# EAGLE design board_revB (EAGLE 7.7.0)
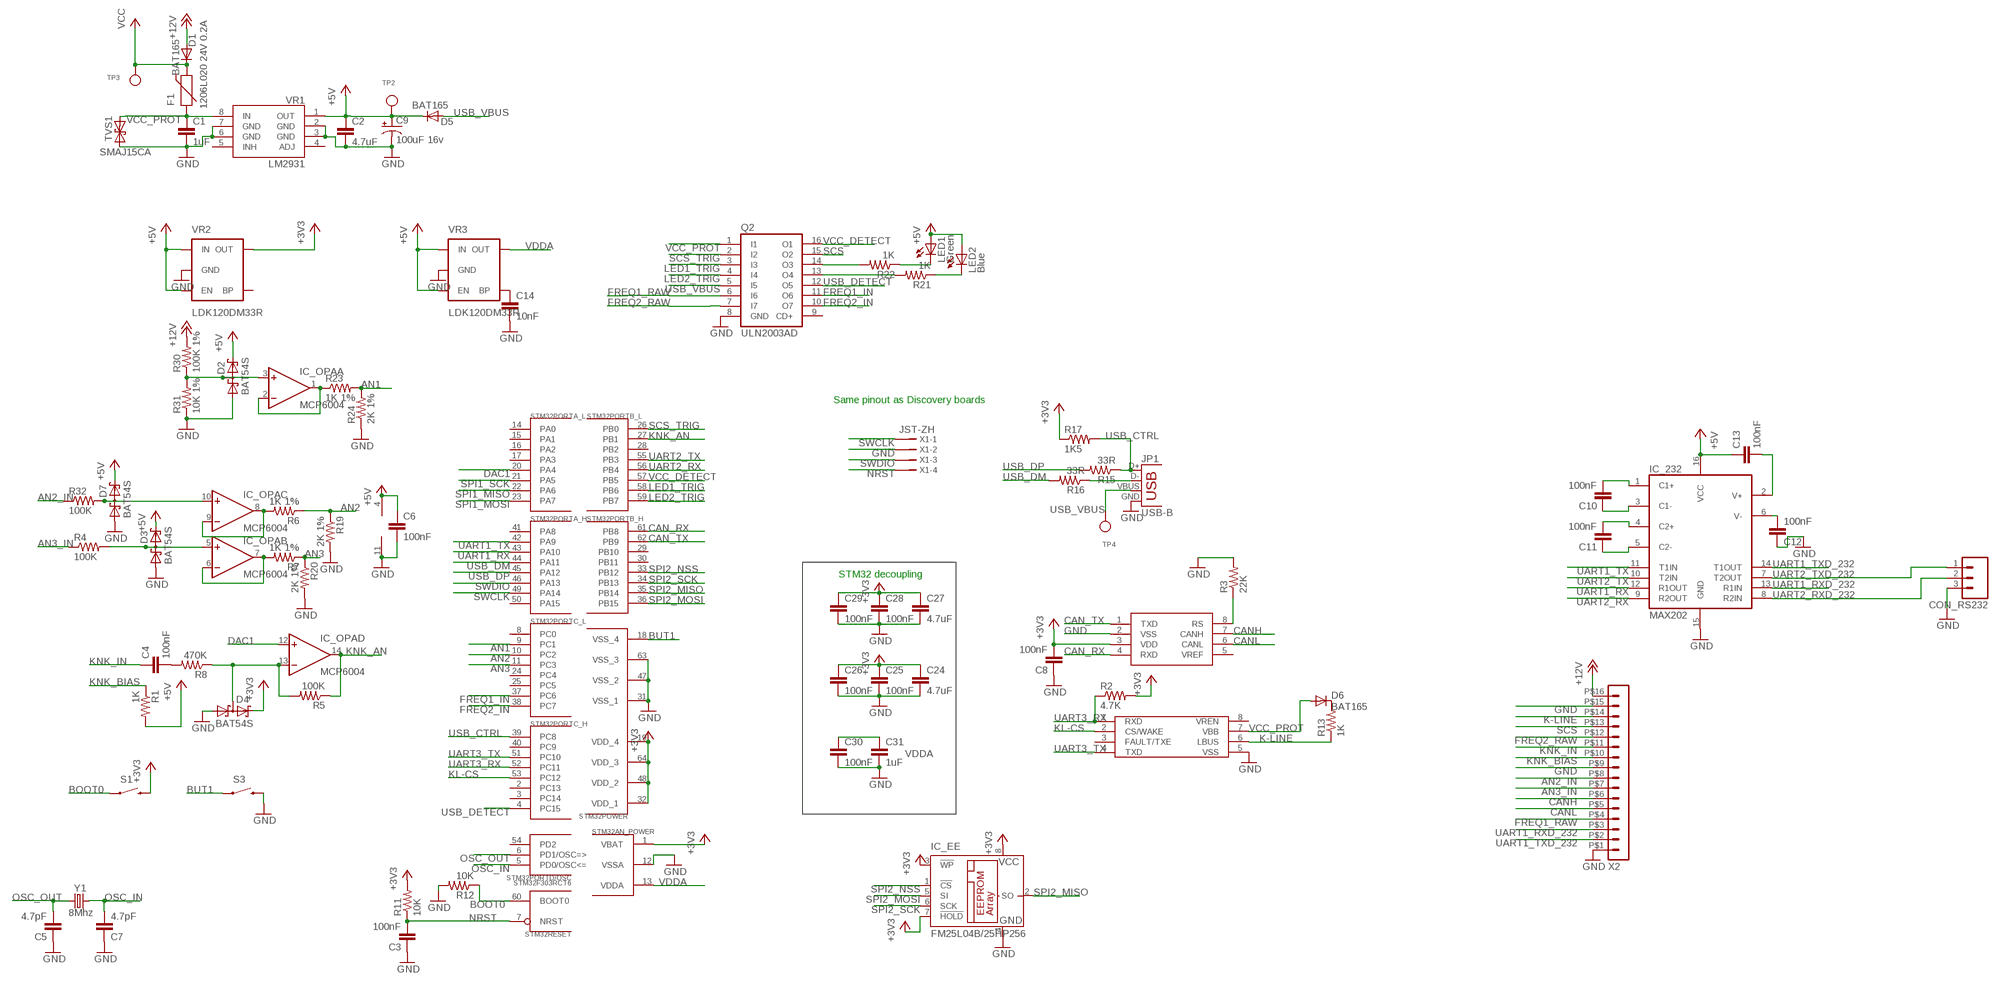
[diagram p0: schematic, sheet 1]

## Parts
C1  1uF  CAP0603-CAP  [0603-CAP]
C2  4.7uF  CAP0603-CAP  [0603-CAP]
C3  100nF  CAP0603-CAP  [0603-CAP]
C4  100nF  CAP0603-CAP  [0603-CAP]
C5  4.7pF  CAP0603-CAP  [0603-CAP]
C6  100nF  CAP0603-CAP  [0603-CAP]
C7  4.7pF  CAP0603-CAP  [0603-CAP]
C8  100nF  CAP0603-CAP  [0603-CAP]
C9  100uF 16v  CAP_POLPTH2  [CPOL-RADIAL-10UF-25V]
C10  100nF  CAP0603-CAP  [0603-CAP]
C11  100nF  CAP0603-CAP  [0603-CAP]
C12  100nF  CAP0603-CAP  [0603-CAP]
C13  100nF  CAP0603-CAP  [0603-CAP]
C14  10nF  CAP0603-CAP  [0603-CAP]
C24  4.7uF  CAP0603-CAP  [0603-CAP]
C25  100nF  CAP0603-CAP  [0603-CAP]
C26  100nF  CAP0603-CAP  [0603-CAP]
C27  4.7uF  CAP0603-CAP  [0603-CAP]
C28  100nF  CAP0603-CAP  [0603-CAP]
C29  100nF  CAP0603-CAP  [0603-CAP]
C30  100nF  CAP0603-CAP  [0603-CAP]
C31  1uF  CAP0603-CAP  [0603-CAP]
CON_RS232  M03LOCK  [1X03_LOCK]
D1  BAT165  DIODESOD  [SOD-323]
D2  BAT54S  [SOT23]
D3  BAT54S  [SOT23]
D4  BAT54S  [SOT23]
D5  BAT165  DIODESOD  [SOD-323]
D6  BAT165  DIODESOD  [SOD-323]
D7  BAT54S  [SOT23]
F1  1206L020 24V 0.2A  PTCSMD  [PTC-1206]
IC_232  MAX202  MAX232TSSOP  [TSSOP16]
IC_CAN  MAX3051  MCP2551  [SO08]
IC_EE  FM25L04B/25HP256  25LC080SN  [SO-08]
IC_KLINE  TJA1027  MCP2004  [SO08]
IC_OPA  MCP6004  LMV324MZ  [TSSOP14]
JP1  USB-B  USBPTH  [USB-B-PTH]
LED1  Green  LED3MM  [LED3MM]
LED2  Blue  LED3MM  [LED3MM]
Q2  ULN2003AD  [SO16]
R1  1K  RESISTOR0603-RES  [0603-RES]
R2  4.7K  RESISTOR0603-RES  [0603-RES]
R3  22K  RESISTOR0603-RES  [0603-RES]
R4  100K  RESISTOR0603-RES  [0603-RES]
R5  100K  RESISTOR0603-RES  [0603-RES]
R6  1K 1%  RESISTOR0603-RES  [0603-RES]
R7  1K 1%  RESISTOR0603-RES  [0603-RES]
R8  470K  RESISTOR0603-RES  [0603-RES]
R11  10K  RESISTOR0603-RES  [0603-RES]
R12  10K  RESISTOR0603-RES  [0603-RES]
R13  1K  RESISTOR0603-RES  [0603-RES]
R15  33R  RESISTOR0603-RES  [0603-RES]
R16  33R  RESISTOR0603-RES  [0603-RES]
R17  1K5  RESISTOR0603-RES  [0603-RES]
R19  2K 1%  RESISTOR0603-RES  [0603-RES]
R20  2K 1%  RESISTOR0603-RES  [0603-RES]
R21  1K  RESISTOR0603-RES  [0603-RES]
R22  1K  RESISTOR0603-RES  [0603-RES]
R23  1K 1%  RESISTOR0603-RES  [0603-RES]
R24  2K 1%  RESISTOR0603-RES  [0603-RES]
R30  100K 1%  RESISTOR0603-RES  [0603-RES]
R31  10K 1%  RESISTOR0603-RES  [0603-RES]
R32  100K  RESISTOR0603-RES  [0603-RES]
S1  SWITCH-MOMENTARY-2SMD-4  [TACTILE_SWITCH_TALL]
S3  SWITCH-MOMENTARY-2SIDE_EZ  [TACTILE-PTH-SIDEEZ]
STM32  STM32F303RCT6  STM32F10XRXT6  [TQFP64]
TP2  TESTPOINTROUND1MM  [TESTPOINT_ROUND_1MM]
TP3  TESTPOINTROUND1MM  [TESTPOINT_ROUND_1MM]
TP4  TESTPOINTROUND1MM  [TESTPOINT_ROUND_1MM]
TVS1  SMAJ15CA  TVS  [SMA-DIODE]
VR1  LM2931  [SO08]
VR2  LDK120DM33R  V_REG_LDOSMD  [SOT23-5]
VR3  LDK120DM33R  V_REG_LDOSMD  [SOT23-5]
X1  JST-ZH  S4B-ZR  [S4B-ZR]
X2  HEADER_POS16_43045-1600  [43045-1600]
Y1  8Mhz  CRYSTALHC49US  [HC49US]

## Nets
+3V3: C8.2 C24.1 C25.1 C26.1 C27.1 C28.1 C29.1 D4.2(C2) IC_CAN.3(VDD) IC_EE.3(!WP) IC_EE.7(!HOLD) IC_EE.8(VCC) R2.2 R11.2 R17.1 S1.B2 STM32.1(AN_POWER:VBAT) STM32.19(POWER:VDD_4) STM32.32(POWER:VDD_1) STM32.48(POWER:VDD_2) STM32.64(POWER:VDD_3) VR2.5(OUT)
+5V: C2.1 C6.1 C9.1(+) C13.1 D2.2(C2) D3.2(C2) D5.1(C) D7.2(C2) IC_232.16(VCC) IC_OPA.4(P:V+) LED1.A LED2.A R1.2 TP2.P$1 VR1.1(OUT) VR2.1(IN) VR2.3(EN) VR3.1(IN) VR3.3(EN)
+12V: D1.2(A) R30.2 X2.P$16
AN1: R23.2 R24.2 STM32.9(PORTC_L:PC1)
AN1_N: IC_OPA.1(A:OUT) IC_OPA.2(A:-IN) R23.1
AN2: R6.1 R19.1 STM32.10(PORTC_L:PC2)
AN2_IN: R32.1 X2.P$8
AN2_N: IC_OPA.8(C:OUT) IC_OPA.9(C:-IN) R6.2
AN3: R7.1 R20.1 STM32.11(PORTC_L:PC3)
AN3_IN: R4.1 X2.P$7
AN3_N: IC_OPA.6(B:-IN) IC_OPA.7(B:OUT) R7.2
BOOT0: R12.1 S1.A2 STM32.60(RESET:BOOT0)
BUT1: S3.1 STM32.18(POWER:VSS_4)
CAN_RX: IC_CAN.4(RXD) STM32.61(PORTB_H:PB8)
CAN_TX: IC_CAN.1(TXD) STM32.62(PORTB_H:PB9)
CANH: IC_CAN.7(CANH) X2.P$6
CANL: IC_CAN.6(CANL) X2.P$5
DAC1: IC_OPA.12(D:+IN) STM32.20(PORTA_L:PA4)
FREQ1_IN: Q2.11(O6) STM32.37(PORTC_L:PC6)
FREQ1_RAW: Q2.6(I6) X2.P$4
FREQ2_IN: Q2.10(O7) STM32.38(PORTC_L:PC7)
FREQ2_RAW: Q2.7(I7) X2.P$12
GND: C1.2 C2.2 C3.1 C5.1 C6.2 C7.1 C8.1 C9.2(-) C12.1 C14.2 C24.2 C25.2 C26.2 C27.2 C28.2 C29.2 C30.2 C31.2 CON_RS232.3 D2.1(A1) D3.1(A1) D4.1(A1) D7.1(A1) IC_232.15(GND) IC_CAN.2(VSS) IC_EE.4(GND) IC_KLINE.5(VSS) IC_OPA.11(P:V-) JP1.GND Q2.8(GND) R3.2 R12.2 R19.2 R20.2 R24.1 R31.1 S3.2 STM32.12(AN_POWER:VSSA) STM32.31(POWER:VSS_1) STM32.47(POWER:VSS_2) STM32.63(POWER:VSS_3) TVS1.A VR1.2(GND) VR1.3(GND) VR1.6(GND) VR1.7(GND) VR2.2(GND) VR3.2(GND) X1.2 X2.P$1 X2.P$9 X2.P$15
K-LINE: IC_KLINE.6(LBUS) R13.1 X2.P$14
KL-CS: IC_KLINE.2(CS/WAKE) STM32.53(PORTC_H:PC12)
KNK_AN: IC_OPA.14(D:OUT) R5.1 STM32.27(PORTB_L:PB1)
KNK_BIAS: R1.1 X2.P$10
KNK_IN: C4.1 X2.P$11
LED1_TRIG: Q2.3(I3) STM32.58(PORTB_L:PB6)
LED2_TRIG: Q2.4(I4) STM32.59(PORTB_L:PB7)
N$4: D4.3(C1A2) IC_OPA.13(D:-IN) R5.2 R8.1
N$5: D3.3(C1A2) IC_OPA.5(B:+IN) R4.2
N$6: C4.2 R8.2
N$8: IC_CAN.8(RS) R3.1
N$9: C14.1 VR3.4(BP)
N$10: LED2.K(C) R21.1
N$11: Q2.13(O4) R21.2
N$13: D6.1(C) R13.2
N$15: Q2.14(O3) R22.2
N$17: JP1.D- R16.1
N$19: LED1.K(C) R22.1
N$20: C11.2 IC_232.4(C2+)
N$22: C11.1 IC_232.5(C2-)
N$23: C10.1 IC_232.3(C1-)
N$24: D2.3(C1A2) IC_OPA.3(A:+IN) R30.1 R31.2
N$25: D7.3(C1A2) IC_OPA.10(C:+IN) R32.2
N$26: C10.2 IC_232.1(C1+)
N$27: C12.2 IC_232.6(V-)
N$29: C13.2 IC_232.2(V+)
NRST: C3.2 R11.1 STM32.7(RESET:NRST) X1.4
OSC_IN: C7.2 STM32.5(PORTD/OSC:PD0/OSC<=) Y1.2
OSC_OUT: C5.2 STM32.6(PORTD/OSC:PD1/OSC=>) Y1.1
SCS: Q2.15(O2) X2.P$13
SCS_TRIG: Q2.2(I2) STM32.26(PORTB_L:PB0)
SPI1_MISO: STM32.22(PORTA_L:PA6)
SPI1_MOSI: STM32.23(PORTA_L:PA7)
SPI1_SCK: STM32.21(PORTA_L:PA5)
SPI2_MISO: IC_EE.2(SO) STM32.35(PORTB_H:PB14)
SPI2_MOSI: IC_EE.5(SI) STM32.36(PORTB_H:PB15)
SPI2_NSS: IC_EE.1(!CS) STM32.33(PORTB_H:PB12)
SPI2_SCK: IC_EE.6(SCK) STM32.34(PORTB_H:PB13)
SWCLK: STM32.49(PORTA_H:PA14) X1.1
SWDIO: STM32.46(PORTA_H:PA13) X1.3
UART1_RX: IC_232.12(R1OUT) STM32.43(PORTA_H:PA10)
UART1_RXD_232: IC_232.13(R1IN) X2.P$3
UART1_TX: IC_232.11(T1IN) STM32.42(PORTA_H:PA9)
UART1_TXD_232: IC_232.14(T1OUT) X2.P$2
UART2_RX: IC_232.9(R2OUT) STM32.56(PORTB_L:PB4)
UART2_RXD_232: CON_RS232.2 IC_232.8(R2IN)
UART2_TX: IC_232.10(T2IN) STM32.55(PORTB_L:PB3)
UART2_TXD_232: CON_RS232.1 IC_232.7(T2OUT)
UART3_RX: IC_KLINE.1(RXD) R2.1 STM32.52(PORTC_H:PC11)
UART3_TX: IC_KLINE.4(TXD) STM32.51(PORTC_H:PC10)
USB_CTRL: JP1.D+ R15.1 R17.2 STM32.39(PORTC_H:PC8)
USB_DETECT: Q2.12(O5) STM32.4(PORTC_H:PC15)
USB_DM: R16.2 STM32.44(PORTA_H:PA11)
USB_DP: R15.2 STM32.45(PORTA_H:PA12)
USB_VBUS: D5.2(A) JP1.VBUS Q2.5(I5) TP4.P$1
VCC: D1.1(C) F1.2 TP3.P$1
VCC_DETECT: Q2.16(O1) STM32.57(PORTB_L:PB5)
VCC_PROT: C1.1 D6.2(A) F1.1 IC_KLINE.7(VBB) Q2.1(I1) TVS1.C VR1.8(IN)
VDDA: C30.1 C31.1 STM32.13(AN_POWER:VDDA) VR3.5(OUT)
Unconnected: IC_CAN.5(VREF) IC_KLINE.3(FAULT/TXE) IC_KLINE.8(VREN) Q2.9(CD+) STM32.2(PORTC_H:PC13) STM32.3(PORTC_H:PC14) STM32.8(PORTC_L:PC0) STM32.14(PORTA_L:PA0) STM32.15(PORTA_L:PA1) STM32.16(PORTA_L:PA2) STM32.17(PORTA_L:PA3) STM32.24(PORTC_L:PC4) STM32.25(PORTC_L:PC5) STM32.28(PORTB_L:PB2) STM32.29(PORTB_H:PB10) STM32.30(PORTB_H:PB11) STM32.40(PORTC_H:PC9) STM32.41(PORTA_H:PA8) STM32.50(PORTA_H:PA15) STM32.54(PORTD/OSC:PD2) VR1.4(ADJ) VR1.5(INH) VR2.4(BP)

## Notes on the sheet
- Same pinout as Discovery boards
- STM32 decoupling

## Library data of the parts
C1 C2 C24 C27 = SparkFun-Passives:CAP: Capacitor Standard 0603 ceramic capacitor, and 0.1" leaded capacitor.
C3-C8 C10-C14 C25 C26 C28-C31 = SparkFun-Capacitors:CAP: Capacitor Standard 0603 ceramic capacitor, and 0.1" leaded capacitor.
C9 = SparkFun-Passives:CAP_POL: Capacitor Polarized These are standard SMD and PTH capacitors. Normally 10uF, 47uF, and 100uF in electrolytic and tantalum varieties. Always verify the external diameter of the through hole cap, it varies with capacity, voltage, and manufacturer. The EIA devices should be standard.
CON_RS232 = SparkFun-Connectors:M03: Header 3 Standard 3-pin 0.1" header. Use with straight break away headers (SKU : PRT-00116), right angle break away headers (PRT-00553), swiss pins (PRT-00743), machine pins (PRT-00117), and female headers (PRT-00115). Molex polarized connector foot print use with SKU : PRT-08232 with associated crimp pins and housings.
D1 D5 D6 = SparkFun-DiscreteSemi:DIODE: Diode These are standard reverse protection diodes and small signal diodes. SMA package can handle up to about 1A. SOD-323 can handle about 200mA. What the SOD-323 package when ordering, there are some mfgs out there that are 5-pin packages.
D2-D4 D7 = diode:BAT54S: Schottky Diodes Pin connection corrected 2011-05-04 Source: Fairchild .. BAT54.pdf
F1 = misc:PTC: Resettable Fuse PTC Resettable Fuse. Spark Fun Electronics SKU : COM-08357; PROD_ID: RES-11150
IC_232 = SparkFun-DigitalIC:MAX232: RS232 Transceiver Very common IC. This is generically called 'MAX232', but works with the 3V equivalent MAX3232 generic ICs. Field tested and mother approved. Spark Fun Electronics SKU : COM-00316 (DIP) and COM-00589 (SMD)
IC_CAN = SparkFun-DigitalIC:MCP2551: CAN transceiver
IC_EE = microchip:25*: Serial EEPROM 4K/ 8K , SPI bus; MF: MICROCHIP; MPN: 25LC080/SN; OC_FARNELL: 1137302; OC_NEWARK: 96K4092
IC_KLINE = misc:MCP2004
IC_OPA = linear:LMV324?*: Quad General Purpose, Low Voltage, Rail-to-Rail Output Operational Amplifiers Source: http://www.national.com/mpf/LM/LMV321.html http://www.national.com/dt/lmv_qual.pdf
JP1 = SparkFun-Connectors:USB: USB Connectors USB-B-PTH is fully proven SKU : PRT-00139/CONN-08278 USB-miniB is fully proven SKU : PRT-00587 USB-A-PCB is untested. USB-A-H is throughly reviewed, but untested. Spark Fun Electronics SKU : PRT-00437 USB-B-SMT is throughly reviewed, but untested. Needs silkscreen touching up. USB-A-S has not been used/tested USB-MB-H has not been used/tested USB-MICROB has been used. CONN-09505; PROD_ID: CONN-08278
LED1 LED2 = SparkFun-LED:LED: LEDs Standard schematic elements and footprints for 5mm, 3mm, 1206, and 0603 sized LEDs. 5mm - Spark Fun Electronics SKU : COM-00529 (and others)
Q2 = misc:ULN2003A: DRIVER ARRAY
R1-R8 R11-R13 R15-R17 R19-R24 R30-R32 = SparkFun-Resistors:RESISTOR: Resistor Basic schematic elements and footprints for 0603, 1206, and PTH resistors.
S1 = SparkFun-Electromechanical:SWITCH-MOMENTARY-2: Various NO switches- pushbuttons, reed, etc; PROD_ID: SWCH-11966
S3 = SparkFun-Electromechanical:SWITCH-MOMENTARY-2: Various NO switches- pushbuttons, reed, etc
STM32 = stm32:STM32F10XRXT6: STM32F101/103 64pin LQFP
TP2-TP4 = microbuilder:TESTPOINT: Test Point Various test points for characterisation and PCB testing TESTPOINT_SMT - Compact Surface Mount Test Point [Digikey: 5016KTR-ND]
TVS1 = SparkFun-DiscreteSemi:TVS: Transient voltage suppressor- prevents ESD on inputs. Ignore package description- MBRA140 is NOT this type of part!!!
VR1 = SparkFun-PowerIC:LM2931: LDO regulator with reverse battery protection- very durable!
VR2 VR3 = SparkFun-PowerIC:V_REG_LDO: Voltage Regulator LDO Standard 150mA LDO voltage regulator in SOT-23 layout. Micrel part MIC5205. BP (by-pass) pin is used to lower output noise with 470pF cap.
X1 = con-jst:?4B-ZR: ZH CONNECTOR 1.5 mm, 4 pin 1 row Source: http://www.jst.com .. eZH.pdf; MF: FARNELL; MPN: S4B-ZR(LF)(SN); OC_FARNELL: 9491830; OC_NEWARK: 38K8076
X2 = con-molex-micro-fit-3_0:HEADER_POS16_?: Molex - Micro-Fit 3.0 Series connector, 3.00mm (0.118") pitch header, 16 positions.
Y1 = SparkFun-FreqCtrl:CRYSTAL: Various standard crystals. Proven footprints. Spark Fun Electronics SKU : COM-00534

## Net classes
1 HV: width 0.813 mm, clearance 0.61 mm

## Board
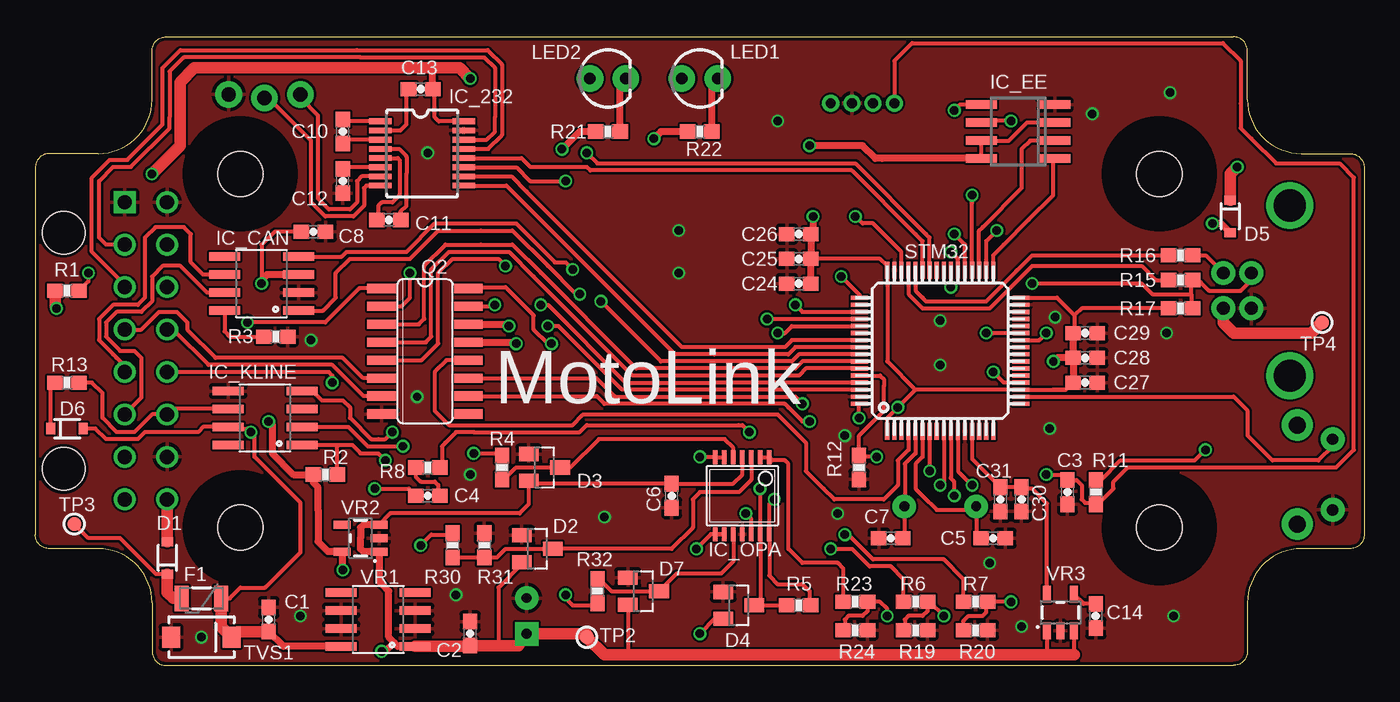
[diagram p1: board, top side]
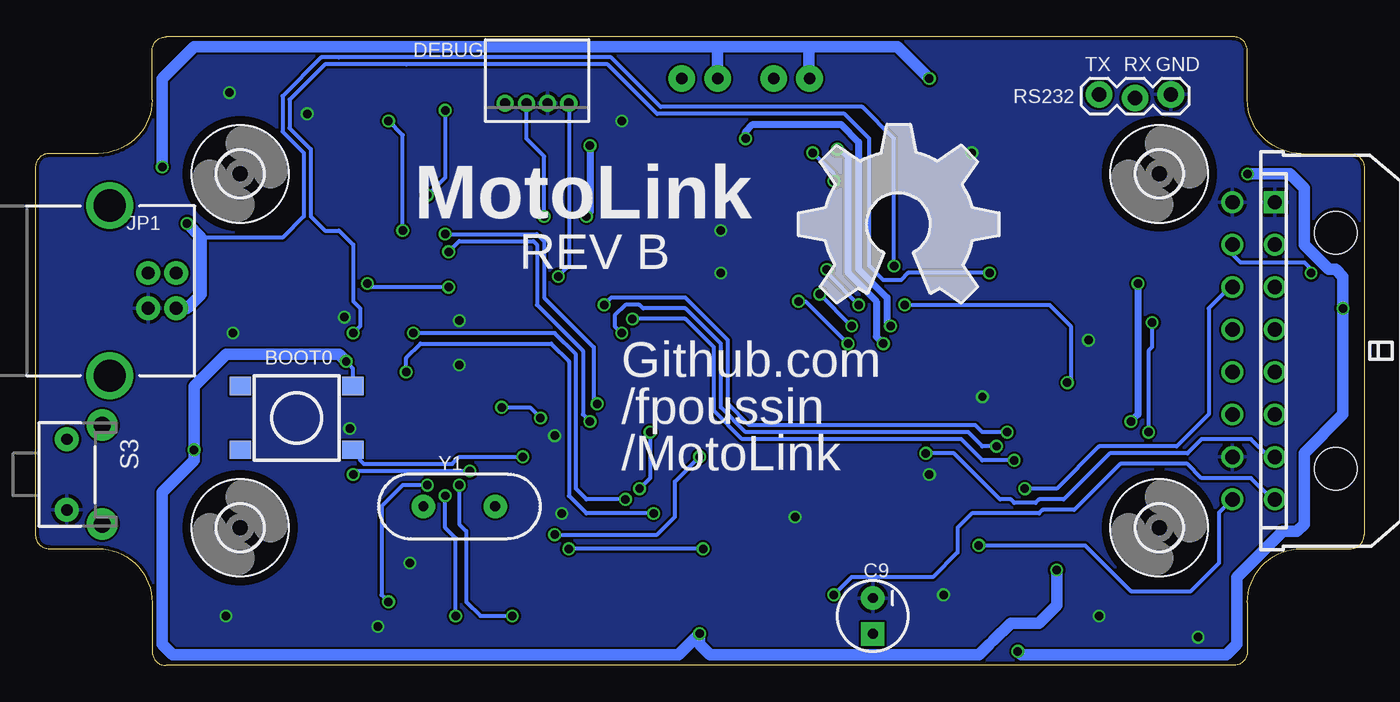
[diagram p2: board, bottom side, seen from below]

Size 93.98 x 44.45 mm. Coordinates in mm from the lower left corner, seen from the top.
Outline: 85.72,4.45 85.72,1 arc-90 84.72,0 9.26,0 arc-90 8.26,1 8.26,4.45 arc90 4.45,8.26 1,8.26 arc-90 0,9.26 0,35.2 arc-90 1,36.2 4.45,36.2 arc90 8.26,40.01 8.26,43.45 arc-90 9.26,44.45 84.72,44.45 arc-90 85.72,43.45 85.72,40.01 arc90 89.53,36.2 92.98,36.2 arc-90 93.98,35.2 93.98,9.26 arc-90 92.98,8.26 89.53,8.26 arc90 85.72,4.45
Copper layers (1*16): Top 0.035mm / dielectric 1.5mm / Bottom 0.035mm
Design rules "SeeedStudio_2layer_DRU_no_angle_20140221 *": minimum track width 8mil, minimum drill 12mil, track to track 6mil, track to pad 6mil, pad to pad 6mil, via to via 6mil, smd to smd 0mil, copper to edge 10mil, drill to drill 10mil, minimum pad ring 10mil, minimum via ring 6mil, stop-mask expansion 2mil, vias tented up to drill 100mil, thermal gap 10mil

### Footprints (pad centres in the part's own frame; a part is rotated, then mirrored left to right if it is on the bottom)
0603-CAP = smd 1.1 x 1: 1 -0.85,0; 2 0.85,0
CPOL-RADIAL-10UF-25V = drill 0.7 pad 1.651 square: 1 1.27,0 | drill 0.7 pad 1.651: 2 -1.27,0
1X03_LOCK = drill 1.016 pad 1.88: 1 0,0.127; 2 2.54,-0.127; 3 5.08,0.127
SOD-323 = smd 0.63 x 0.83: 1 -1.15,0; 2 1.15,0
SOT23 = smd 1 x 1.4: 1 -0.95,-1.1; 2 0.95,-1.1; 3 0,1.1
PTC-1206 = smd 1 x 1.8: 1 -1.4,0; 2 1.4,0
TSSOP16 = smd 0.4 x 1.6: 1 -2.225,-2.85; 2 -1.575,-2.85; 3 -0.925,-2.85; 4 -0.275,-2.85; 5 0.375,-2.85; 6 1.025,-2.85; 7 1.675,-2.85; 8 2.325,-2.85; 9 2.325,3.05; 10 1.675,3.05; 11 1.025,3.05; 12 0.375,3.05; 13 -0.275,3.05; 14 -0.925,3.05; 15 -1.575,3.05; 16 -2.225,3.05
SO08 = smd 0.61 x 2.21: 1 -1.905,-2.616; 2 -0.635,-2.616; 3 0.635,-2.616; 4 1.905,-2.616; 5 1.905,2.616; 6 0.635,2.616; 7 -0.635,2.616; 8 -1.905,2.616
SO-08 = smd 0.6 x 2.2: 1 -1.905,-2.6; 2 -0.635,-2.6; 3 0.635,-2.6; 4 1.905,-2.6; 5 1.905,2.6; 6 0.635,2.6; 7 -0.635,2.6; 8 -1.905,2.6
TSSOP14 = smd 0.305 x 0.991: 1 -1.905,-2.718; 2 -1.27,-2.718; 3 -0.635,-2.718; 4 0,-2.718; 5 0.635,-2.718; 6 1.27,-2.718; 7 1.905,-2.718; 8 1.905,2.718; 9 1.27,2.718; 10 0.635,2.718; 11 0,2.718; 12 -0.635,2.718; 13 -1.27,2.718; 14 -1.905,2.718
USB-B-PTH = drill 0.914 pad 1.676: D+ 0,1.25; D- 1.981,1.25; GND 0,-1.25; VBUS 1.981,-1.25 | drill 2.286: S1 -2.718,-6.02; S2 -2.718,6.02
LED3MM = drill 0.813 pad 1.88: A -1.27,0; K 1.27,0
SO16 = smd 0.66 x 2.032: 1 -4.445,-3.073; 2 -3.175,-3.073; 3 -1.905,-3.073; 4 -0.635,-3.073; 5 0.635,-3.073; 6 1.905,-3.073; 7 3.175,-3.073; 8 4.445,-3.073; 9 4.445,3.073; 10 3.175,3.073; 11 1.905,3.073; 12 0.635,3.073; 13 -0.635,3.073; 14 -1.905,3.073; 15 -3.175,3.073; 16 -4.445,3.073
0603-RES = smd 1.1 x 1: 1 -0.85,0; 2 0.85,0
TACTILE_SWITCH_TALL = smd 1.55 x 1.3: A1 -3.975,-2.25; A2 3.975,-2.25; B1 -3.975,2.25; B2 3.975,2.25
TACTILE-PTH-SIDEEZ = drill 0.8 pad 1.7: 1 -2.5,0; 2 2.5,0 | drill 1.2 pad 2.2: ANCHOR1 -3.5,2.5; ANCHOR2 3.5,2.5
TQFP64 = smd 1.2 x 0.3: 1 -5.7,3.75; 2 -5.7,3.25; 3 -5.7,2.75; 4 -5.7,2.25; 5 -5.7,1.75; 6 -5.7,1.25; 7 -5.7,0.75; 8 -5.7,0.25; 9 -5.7,-0.25; 10 -5.7,-0.75; 11 -5.7,-1.25; 12 -5.7,-1.75; 13 -5.7,-2.25; 14 -5.7,-2.75; 15 -5.7,-3.25; 16 -5.7,-3.75; 33 5.7,-3.75; 34 5.7,-3.25; 35 5.7,-2.75; 36 5.7,-2.25; 37 5.7,-1.75; 38 5.7,-1.25; 39 5.7,-0.75; 40 5.7,-0.25; 41 5.7,0.25; 42 5.7,0.75; 43 5.7,1.25; 44 5.7,1.75; 45 5.7,2.25; 46 5.7,2.75; 47 5.7,3.25; 48 5.7,3.75 | smd 0.3 x 1.2: 17 -3.75,-5.7; 18 -3.25,-5.7; 19 -2.75,-5.7; 20 -2.25,-5.7; 21 -1.75,-5.7; 22 -1.25,-5.7; 23 -0.75,-5.7; 24 -0.25,-5.7; 25 0.25,-5.7; 26 0.75,-5.7; 27 1.25,-5.7; 28 1.75,-5.7; 29 2.25,-5.7; 30 2.75,-5.7; 31 3.25,-5.7; 32 3.75,-5.7; 49 3.75,5.7; 50 3.25,5.7; 51 2.75,5.7; 52 2.25,5.7; 53 1.75,5.7; 54 1.25,5.7; 55 0.75,5.7; 56 0.25,5.7; 57 -0.25,5.7; 58 -0.75,5.7; 59 -1.25,5.7; 60 -1.75,5.7; 61 -2.25,5.7; 62 -2.75,5.7; 63 -3.25,5.7; 64 -3.75,5.7
TESTPOINT_ROUND_1MM = smd 1 x 1: P$1 0,0
SMA-DIODE = smd 1.27 x 1.47: A -2.15,0; C 2.15,0
3,2 = hole 3.2: 0,0
SOT23-5 = smd 0.55 x 1.2: 1 -0.95,-1.3; 2 0,-1.3; 3 0.95,-1.3; 4 0.95,1.3; 5 -0.95,1.3
S4B-ZR = drill 0.7 pad 1.1: 1 -2.25,0; 2 -0.75,0; 3 0.75,0; 4 2.25,0
43045-1600 = drill 1.02 square: P$1 10.5,4.32 | drill 1.02: P$2 7.5,4.32; P$3 4.5,4.32; P$4 1.5,4.32; P$5 -1.5,4.32; P$6 -4.5,4.32; P$7 -7.5,4.32; P$8 -10.5,4.32; P$9 10.5,7.32; P$10 7.5,7.32; P$11 4.5,7.32; P$12 1.5,7.32; P$13 -1.5,7.32; P$14 -4.5,7.32; P$15 -7.5,7.32; P$16 -10.5,7.32 | hole 3: 8.35,0; -8.35,0
HC49US = drill 0.7 pad 1.651: 1 -2.54,0; 2 2.54,0

### Placement (x,y rotation side)
C1  16.5,3.25 90 top
C2  30.75,2.25 90 top
C3  73,12.25 90 top
C4  27.75,12 0 top
C5  67.75,9 180 top
C6  45,12 270 top
C7  60.5,9 0 top
C8  19.68,30.66 180 top
C9  34.75,3.5 270 bottom
C10  21.75,37.75 90 top
C11  25,31.5 0 top
C12  21.75,34.25 90 top
C13  27.25,40.75 180 top
C14  75,3.5 270 top
C24  54,27 180 top
C25  54,28.75 180 top
C26  54,30.5 180 top
C27  74.25,20 0 top
C28  74.25,21.75 0 top
C29  74.25,23.5 0 top
C30  69.75,11.75 270 top
C31  68.25,11.75 270 top
CON_RS232  18.75,40.25 0 bottom
D1  9.34,7.61 90 top
D2  35.5,8.25 270 top
D3  36,14 270 top
D4  49.75,4.25 270 top
D5  84.5,31.75 270 top
D6  2.25,16.75 0 top
D7  43,5.25 270 top
F1  11.75,4.75 180 top
IC_232  27.25,36.25 270 top
IC_CAN  16,27 90 top
IC_EE  69.5,37.75 90 top
IC_KLINE  16.25,17.5 90 top
IC_OPA  50,12 180 top
JP1  86,26.5 0 bottom
LED1  47,41.5 0 top
LED2  40.5,41.5 0 top
Q2  27.56,22.22 270 top
R1  2.25,26.5 180 top
R2  20.5,13.5 180 top
R3  17,23.25 0 top
R4  33,14 270 top
R5  54,4.25 180 top
R6  62.25,4.5 180 top
R7  66.5,4.5 180 top
R8  27.75,14 180 top
R11  75,12.25 90 top
R12  58.25,14 270 top
R13  2.25,20 180 top
R15  81,27.25 180 top
R16  81,29 180 top
R17  81,25.25 0 top
R19  62.25,2.5 0 top
R20  66.5,2.5 0 top
R21  40.5,37.75 180 top
R22  47,37.75 180 top
R23  58,4.5 0 top
R24  58,2.5 180 top
R30  29.5,8.5 90 top
R31  31.75,8.5 270 top
R32  39.75,5.25 90 top
S1  75.5,17.5 0 bottom
S3  91.75,13.5 270 bottom
STM32  64,22.25 90 top
TP2  39,2 90 top
TP3  2.75,10 0 top
TP4  91,24.25 180 top
TVS1  11.75,2 0 top
U$2  [3,2]  14.5,34.75 0 bottom
U$3  [3,2]  14.5,9.75 0 bottom
U$4  [3,2]  79.5,34.75 0 bottom
U$5  [3,2]  79.5,9.75 0 bottom
U$6  [OSHW_FILLX500_NOTEXT]  39.99,25.6 0 bottom
VR1  24.25,3.25 90 top
VR2  23,9 90 top
VR3  72.5,3.75 0 top
X1  58.5,39.75 180 bottom
X2  2,22.25 90 bottom
Y1  64,11.25 0 bottom

### Tracks (layer width: path | path; a pad name or v marks a point on that pad's centre or on a via)
+3V3  (via drill 0.6)
  Top 0.3: v16,27 16,29.75 16.82,30.57 16.91,30.66 C8.2 | IC_EE.8 IC_EE.7 68.86,37.12 69.5,37.75 70.14,38.38 IC_EE.3 | D4.2 48.05,3.3 v47,2.25 | 72,19.5 STM32.19 62.25,19.5 | 72,19.5 72.9,19.5 | 72.9,19.5 72,19.5 | 72,19.5 72.9,19.5 | 72.9,19.5 72,19.5 | 72,19.5 72.9,19.5 | 72.9,19.5 C27.1 | STM32.32 72.25,26 73.5,24.75 | 73.5,24.75 73.5,23.65 C29.1 | R11.2 75.35,13.1 76.75,14.5 80.75,14.5 82,14.5 v82.75,15.25 | STM32.1 60.25,17.5 v61,18.25 62.25,19.5 | v58.25,17.5 58.25,18.45 STM32.64 | C25.1 59.75,28.75 60.25,28.25 STM32.48 60.25,21.5 62.25,19.5 | 55,30.65 C26.1 | R17.1 74,25.25 73.5,24.75
  Top 0.5: IC_CAN.3 16.39,27.64 16,27.25 v16,27 | v21.75,6.75 21.75,8 VR2.5 20.7,8.05 20,8.75 20,11 20,12.6 19.65,12.95 R2.2 18.25,13.5 16.75,15 16.75,17 v16.5,17.25 | C26.1 C25.1 C24.1 | v55,31.75 55,30.65 | IC_EE.8 59.91,35.84 59.41,35.84 58.5,36.75 v54.75,36.75 | C28.1 C27.1 | C28.1 C29.1 | C28.1 72.25,21.75 v72,21.5
  Bottom 0.3: v61,18.25 59,18.25 v58.25,17.5 | v72,21.5 71.53,21 S1.B2
  Bottom 0.5: v16,27 16,17.75 v16.5,17.25 | 26.5,1.5 26.25,1.75 | v54.75,36.75 54.75,32 v55,31.75
  Bottom 0.8: 26.5,1.5 27.25,0.75 46.25,0.75 47,1.5 v47,2.25 48.5,0.75 51.25,0.75 84.25,0.75 85,1.5 85,10 85,11.75 85,12.25 82.75,14.5 v82.75,15.25 82.75,19.75 80.5,22 74.5,22 72.5,22 v72,21.5 | 26.25,1.75 25,3 23,3 21.75,4.25 v21.75,6.75
+5V  (via drill 0.6)
  Top 0.3: IC_232.16 28.52,38.48 28.25,38.75 28.25,40.6 C13.1 | D2.2 34.4,7.15 32.75,5.5 32.75,1.65 32.5,1.4 | VR3.3 73.45,0.8 73.5,0.75 | VR3.1 71.55,0.8 71.5,0.75 | VR2.3 25.1,10.75 34.25,10.75 34.9,11.4 D3.2 35.35,12.85 C6.1 49.35,12.85 50,13.5 IC_OPA.4 | D7.2 41.9,0.85 42,0.75
  Top 0.5: VR1.1 25.66,1.34 25.38,1.62 | 25.38,1.62 25,2 25,5.25 24.55,5.7 24.3,5.95 VR2.1 23.2,8.05 23,8.25 23,9 23,9.75 23.2,9.95 VR2.3 | v24.5,1 24.75,1 25.38,1.62 | 38.98,2.23 TP2.P$1 | C13.1 28.1,42.1 28.25,42.25
  Top 0.8: VR1.1 30.58,1.34 C2.1 32.5,1.4 34.17,1.4 C9.1 38.98,2.23 | R1.2 1.4,25.35 v1.5,25.25 | v8.25,34.75 10.25,36.75 10.25,41.25 11.25,42.25 28.25,42.25 29.75,42.25 30,42.25 v30.75,41.5 | TP2.P$1 40.25,0.75 42,0.75 71.5,0.75 73.5,0.75 | D5.1 84.5,34.75 v85,35.25
  Bottom 0.8: v24.5,1 24.25,0.75 9.75,0.75 9,1.5 9,6.25 5.75,9.5 4.75,9.5 4.25,10 4.25,15 1.5,17.75 v1.5,25.25 1.5,27.5 2,28 2.5,28 3.25,28.75 4.25,29.75 4.25,33.75 5.25,34.75 v8.25,34.75 | v85,35.25 85,41.5 82.75,43.75 45.75,43.75 | 45.75,43.75 33.3,43.75 | 33.3,43.75 33,43.75 v30.75,41.5 | 33.3,43.75 39,43.75 39.25,43.5 39.25,41.52 LED2.A | LED1.A 45.73,43.73 45.75,43.75
+12V  (via drill 0.6)
  Top 0.3: v27.25,8.5 28,9.25 29.4,9.25 R30.2
  Top 0.8: D1.2 9.34,11.73 X2.P$16
  Bottom 0.3: v27.25,8.5 19.75,8.5 16.5,5.25 12.25,5.25 10.25,7.25 10.25,10.82 X2.P$16
AN1  (via drill 0.6)
  Top 0.3: R24.2 57.25,2.6 57.25,3.25 57.5,3.5 58.5,3.5 58.85,3.85 R23.2 59.75,4.5 60.25,4 v60.25,3.5 | STM32.9 64.25,13 v64,12.75
  Bottom 0.3: v64,12.75 64,10 63.5,9.5 63.5,4.5 62.5,3.5 v60.25,3.5
AN1_N
  Top 0.3: R23.1 57.15,6.85 56.75,7.25 54.25,7.25 53.25,8.25 53.25,14.25 53,14.5 52.12,14.5 IC_OPA.1 IC_OPA.2
AN2  (via drill 0.6)
  Top 0.3: R19.1 61.5,2.6 61.5,3.25 61.75,3.5 62.75,3.5 63.1,3.85 R6.1 63.25,4.5 v64.25,3.5 | v65,12 65,13 64.75,13.25 STM32.10
  Bottom 0.3: v64.25,3.5 64.25,9 65,9.75 v65,12
AN2_IN  (via drill 0.6)
  Top 0.3: v37.5,5 37.5,4.75 38,4.25 39.6,4.25 R32.1
  Bottom 0.3: X2.P$8 6.5,11.75 8,13.25 11.5,13.25 12.5,14.25 17.25,14.25 20.5,11 22.75,11 23,10.75 27.75,10.75 28.75,9.75 28.75,8 30.5,6.25 36.25,6.25 v37.5,5
AN2_N  (via drill 0.6)
  Top 0.3: R6.2 61.4,6.1 60.5,7 59,7 57.75,8.25 v56.25,8.25 | IC_OPA.8 IC_OPA.9 47.78,9.28 v46.75,8.25
  Bottom 0.3: v46.75,8.25 v56.25,8.25
AN3  (via drill 0.6)
  Top 0.3: R20.1 65.65,3.15 66,3.5 67,3.5 67.25,3.75 67.25,4.4 R7.1 v69,4.5 | STM32.11 65.25,13.75 v66.25,12.75
  Bottom 0.3: v66.25,12.75 68,12.75 69.5,11.25 69.5,5 v69,4.5
AN3_IN  (via drill 0.6)
  Top 0.3: v31,15 32.9,15 R4.1
  Bottom 0.3: X2.P$7 6.75,14.75 8,16 11.5,16 12.5,15 18,15 21.25,11.75 23,11.75 23.25,11.5 24.75,11.5 25,11.75 25.75,11.75 29,15 v31,15
AN3_N  (via drill 0.6)
  Top 0.3: R7.2 65.65,6.1 64.25,7.5 59.25,7.5 58.25,8.5 57.5,9.25 v57.25,9.25 | IC_OPA.6 IC_OPA.7 48.06,14.75 v47,14.75
  Bottom 0.3: v57.25,9.25 50,9.25 48.75,10.5 48.75,13 v47,14.75
BOOT0  (via drill 0.6)
  Top 0.3: STM32.60 59.75,20.5 60,20.25 60,19.75 60,18 58.25,16.25 R12.1 58.35,14.75 v59.5,14.75
  Bottom 0.3: v59.5,14.75 64,14.75 64.5,14.25 70.75,14.25 71,14.5 71,14.97 S1.A2
BUT1
  Top 0.3: STM32.18 84.75,19 85.75,18 85.75,16.25 87.5,14.5 90.75,14.5 91.75,15.5 S3.1
CAN_RX  (via drill 0.6)
  Top 0.3: IC_CAN.4 21.66,28.91 22,29.25 22.25,29.25 26.25,29.25 28.25,31.25 31.5,31.25 34,31.25 36.75,28.5 37.5,28.5 v38,28 | STM32.61 48,20 41.75,20 36.25,25.5 v35.75,25.5
  Bottom 0.3: v38,28 38,27.75 v35.75,25.5
CAN_TX  (via drill 0.6)
  Top 0.3: IC_CAN.1 20.34,25.09 21.25,26 21.25,27.75 22.25,28.75 26.5,28.75 28.5,30.75 31.5,30.75 33.75,30.75 36.25,28.25 38.25,26.25 v38.5,26.25 | STM32.62 48,19.5 41.5,19.5 40.75,20.25 37,24 v36.25,24
  Bottom 0.3: v36.25,24 v38.5,26.25
CANH
  Top 0.3: IC_CAN.7 12.13,26.36 10.75,27.75 10.25,28.25 9,28.25 8.25,27.5 8.25,25.75 7.5,25 5.75,25 5,24.25 5,23.25 6,22.25 7,22.25 7.5,21.75 7.5,18.93 X2.P$6
CANL
  Top 0.3: IC_CAN.6 11.87,27.64 11,28.5 11,30.5 10.5,31 8.5,31 7.75,30.25 7.75,26 7.25,25.5 5.5,25.5 4.5,24.5 4.5,23 5.5,22 5.75,21.75 6.25,21.25 6.25,20.82 X2.P$5
DAC1  (via drill 0.6)
  Top 0.3: IC_OPA.12 50.63,10.37 v50.25,10.75 | STM32.20 68.5,20 v67.75,20.75
  Bottom 0.3: v50.25,10.75 55,10.75 56.25,12 56.25,21.5 57.5,22.75 66.75,22.75 67.75,21.75 v67.75,20.75
FREQ1_IN  (via drill 0.6)
  Top 0.3: STM32.37 65.75,29.75 v65,30.5 | Q2.11 39.69,20.31 39.75,20.25 41,19 53.75,19 v54.25,18.5
  Bottom 0.3: v65,30.5 58.5,30.5 58,30 58,26 54.5,22.5 54.5,18.75 v54.25,18.5
FREQ1_RAW
  Top 0.3: X2.P$4 7.5,23.75 8.75,25 10,25 10.75,24.25 10.75,23.75 12.75,21.75 21.75,21.75 23.19,20.31 Q2.6
FREQ2_IN  (via drill 0.6)
  Top 0.3: STM32.38 65.25,28.75 v64.75,29.25 | v54.75,17.25 54.25,17.25 53.25,18.25 53,18.5 40.25,18.5 39.75,19 39.71,19.04 Q2.10
  Bottom 0.3: v64.75,29.25 64,30 58.75,30 58.5,29.75 58.5,25.5 55.25,22.25 55.25,17.75 v54.75,17.25
FREQ2_RAW
  Top 0.3: X2.P$12 9.75,23.75 12.25,21.25 21,21.25 23.21,19.04 Q2.7
GND  (via drill 0.6)
  other vias: 29.75,5 18.75,3.5 11.75,2 30.75,13.5 67.5,7.25 72.12,24.62 45.5,30.75 45.5,27.75 80.25,40.5 56.75,10.75 69.75,2.75 57.25,16.25 52.5,38.5 74.75,39 27.75,36.25 27,19 19.5,23 80.5,3.5 80,23.5 71.75,16.75 64,21.25 64,24.38 40.25,10.5
  pour Bottom: 0,44.45 93.98,44.45 93.98,0 0,0
  pour Top: 0,44.45 93.98,44.45 93.98,0 0,0
K-LINE
  Top 0.3: IC_KLINE.6 9.71,18.14 X2.P$14 9,17.75 8.25,17.75 7,16.5 5.75,16.5 4.75,17.5 4.75,19.25 4,20 R13.1
KL-CS  (via drill 0.6)
  Top 0.3: IC_KLINE.2 22.14,16.86 23.5,15.5 24.25,15.5 v26,15.5 | v52.5,23.5 53,23.5 53.5,24 STM32.53
  Bottom 0.3: v26,15.5 27,15.5 28,16.5 43.75,16.5 45.5,18.25 45.5,22.75 48,25.25 51,25.25 51.25,25.5 52.25,25.5 53,24.75 53,24 v52.5,23.5
KNK_AN  (via drill 0.6)
  Top 0.3: R5.1 54.75,4.35 54.75,5.25 54.25,5.75 52.5,5.75 51.91,6.34 IC_OPA.14 51.91,11.4 v52.25,11.75 | v67.25,23.5 67.75,23.5 STM32.27
  Bottom 0.3: v52.25,11.75 55,11.75 55.75,12.5 55.75,22 57.25,23.5 v67.25,23.5
KNK_BIAS  (via drill 0.6)
  Top 0.3: 3.25,26.65 R1.1 3.75,27.15 v3.75,27.75
  Bottom 0.3: X2.P$10 9.32,29.07 8.75,28.5 4.25,28.5 3.75,28 v3.75,27.75
KNK_IN  (via drill 0.6)
  Top 0.3: v24,12.5 26.4,12.5 C4.1
  Bottom 0.3: X2.P$11 9.5,26.75 11,25.25 11,17.75 13.25,15.5 18.75,15.5 21.75,12.5 v24,12.5
LED1_TRIG
  Top 0.3: Q2.3 27.12,24.12 27.5,24.5 27.5,28.25 29,29.75 31.5,29.75 33.75,29.75 35.75,27.75 42.25,21.25 42.5,21 53.75,21 54.25,21.5 STM32.58
LED2_TRIG
  Top 0.3: Q2.4 27.6,22.85 28,23.25 28,28 29.25,29.25 31.5,29.25 33.5,29.25 35.25,27.5 42.25,20.5 54,20.5 54.5,21 STM32.59
N$4  (via drill 0.6)
  Top 0.3: R5.2 D4.3 51.27,4.67 IC_OPA.13 51.27,12.48 v51.25,12.5 | 28.6,14.1 R8.1 28.75,14.15 28.75,15.5 29,15.75 29.75,16.5 31,16.5 38.5,16.5 39,17 49.75,17 50,17 v50.5,16.5
  Bottom 0.3: v50.5,16.5 50.5,13.25 v51.25,12.5
N$5
  Top 0.3: IC_OPA.5 49.37,15.38 48.75,16 39.85,16 37.85,14 D3.3 34,14 33.15,13.15 R4.2
N$6
  Top 0.3: R8.2 26.9,13.35 27.25,13 28.25,13 28.5,12.75 28.5,12.1 C4.2
N$8
  Top 0.3: IC_CAN.8 13.38,23.62 13.75,23.25 R3.1
N$9
  Top 0.3: C14.1 74.15,4.35 VR3.4
N$10
  Top 0.5: R21.1 41.35,41.08 LED2.K
N$11  (via drill 0.6)
  Top 0.5: R21.2 38.5,37.75 v37.25,36.5 | Q2.13 33.9,22.85 v34,22.75
  Bottom 0.5: v37.25,36.5 37,36.5 36.5,36 36.5,27.75 34.5,25.75 34.5,23.25 v34,22.75
N$13
  Top 0.3: D6.1 1.1,19.7 R13.2
N$15  (via drill 0.6)
  Top 0.5: R22.2 44.25,37.75 v43.75,37.25 | Q2.14 33.38,24.12 v33.5,24
  Bottom 0.5: v43.75,37.25 43.75,37.75 43.25,38.25 37,38.25 35.75,37 35.75,28 33.75,26 33.75,24.25 v33.5,24
N$17
  Top 0.3: R16.1 82.77,29 JP1.D-
N$19
  Top 0.5: R22.1 47.85,41.08 LED1.K
N$20
  Top 0.3: C11.2 25.85,32.1 26.25,32.5 26.25,34.75 26.25,36 25.73,36.52 IC_232.4
N$22
  Top 0.3: IC_232.5 25.62,35.88 25.75,35.75 25.75,33.25 25.25,32.75 24.5,32.75 24.25,32.5 24.25,31.6 C11.1
N$23
  Top 0.3: IC_232.3 21.77,37.17 C10.1
N$24
  Top 0.3: R30.1 R31.2 32.65,7.65 33.25,8.25 D2.3 45,8.25 46.5,9.75 46.5,11.75 47,12.25 49.75,12.25 50.63,13.13 IC_OPA.3
N$25
  Top 0.3: R32.2 39.9,6.1 40.75,5.25 D7.3 45.35,6.5 48.5,6.5 49.37,7.37 IC_OPA.10
N$26
  Top 0.3: IC_232.1 21.62,38.48 C10.2
N$27
  Top 0.3: IC_232.6 21.62,35.23 C12.2
N$29
  Top 0.3: IC_232.2 25.82,37.83 26.25,38.25 26.25,40.6 C13.2
NRST  (via drill 0.6)
  Top 0.3: STM32.7 63.25,14 v63.25,13.75 | v71.5,13.5 72.6,13.5 C3.2 73.65,13.1 74,12.75 74,11.75 74.25,11.5 74.9,11.5 R11.1 75.15,11.4 76.25,12.5 76.25,13 77.25,14 88.75,14 92,14 93.25,15.25 93.25,34.5 92.25,35.5 87.75,35.5 86,37.25 85.25,38 85.25,39.75 85.25,42.75 84,44 62,44 60.75,42.75 X1.4
  Bottom 0.3: v63.25,13.75 71.25,13.75 v71.5,13.5
OSC_IN
  Top 0.3: STM32.5 62.25,15 61.5,14.25 61.5,11.29 Y1.2 61.46,9.11 C7.2
OSC_OUT
  Top 0.3: C5.2 66.54,9.36 Y1.1 66.29,11 63.75,11 62.75,12 62.25,12.5 62.25,14.25 62.75,14.75 STM32.6
SCS  (via drill 0.6)
  Top 0.3: X2.P$13 20.75,20.75 21,20.5 v21,20 | Q2.15 32.36,25.39 v32.5,25.5
  Bottom 0.3: v32.5,25.5 22.25,25.5 20.75,24 20.75,20.25 v21,20
SCS_TRIG  (via drill 0.6)
  Top 0.3: Q2.2 25.89,25.39 26.5,26 26.5,27.25 v26.5,27.75 | STM32.26 71,23 v71.5,23.5
  Bottom 0.3: v26.5,27.75 32.25,27.75 32.75,27.25 34,27.25 35,28.25 35,37.25 36.75,39 50,39 53.5,42.5 67.75,42.5 73.5,42.5 76,40 76,38 74.5,36.5 74.5,31.75 73.5,30.75 72.5,30.75 71.5,29.75 71.5,25.75 71,25.25 71,24 v71.5,23.5
SPI2_MISO
  Top 0.3: STM32.35 66.75,30.75 67,31 69.75,33.75 69.75,36.5 70.36,37.12 IC_EE.2
SPI2_MOSI  (via drill 0.6)
  Top 0.3: IC_EE.5 65.41,39.66 v65,39.25 | v66.25,33.25 66.25,32.75 STM32.36
  Bottom 0.3: v65,39.25 65,34.5 v66.25,33.25
SPI2_NSS
  Top 0.3: STM32.33 67.75,29 68.5,29.75 70.25,31.5 72,33.25 72,35.74 IC_EE.1
SPI2_SCK  (via drill 0.6)
  Top 0.3: STM32.34 67.25,30 v68,30.75 | v69,38.5 67.02,38.5 IC_EE.6
  Bottom 0.3: v68,30.75 68,37.5 v69,38.5
SWCLK  (via drill 0.6)
  Top 0.3: STM32.49 58.3,26.2 v57,27.5
  Bottom 0.3: v57,27.5 56.75,27.75 56.25,28.25 X1.1
SWDIO  (via drill 0.6)
  Top 0.3: STM32.46 61.25,29.25 59.25,31.25 58.5,31.25 v58,31.75
  Bottom 0.3: X1.3 59.25,37.25 58,36 v58,31.75
UART1_RX
  Top 0.3: IC_232.12 34.38,35.88 35,35.25 39,35.25 39.25,35 57.75,35 62.25,30.5 62.75,30 STM32.43
UART1_RXD_232
  Top 0.3: X2.P$3 6.32,26.93 4,29.25 4,34.5 5.25,35.75 6.5,35.75 9,38.25 9,39 9,42.25 10.25,43.5 22.75,43.5 32,43.5 33,42.5 33,37.5 32.02,36.52 IC_232.13
UART1_TX  (via drill 0.6)
  Top 0.3: IC_232.11 34.02,35.23 35,34.25 v37.5,34.25 | STM32.42 63.25,30.25 63,30.5 58,35.5 39.75,35.5 v39,36.25
  Bottom 0.3: v37.5,34.25 37.5,34.75 v39,36.25
UART1_TXD_232
  Top 0.3: X2.P$2 5,29.75 4.5,30.25 4.5,34.25 5.5,35.25 6.75,35.25 9.5,38 9.5,38.75 9.5,42 10.5,43 23,43 31.75,43 32.5,42.25 32.5,38.75 32.5,37.75 31.93,37.17 IC_232.14
UART2_RX
  Top 0.3: IC_232.9 33.33,33.92 34.75,32.5 45.25,22 48,22 53.25,22 53.75,22.5 STM32.56
UART2_RXD_232
  Top 0.3: IC_232.8 23.43,33.92 23.25,33.75 23.25,32.5 22.5,31.75 20.5,31.75 19.5,32.75 19.5,37.09 16.46,40.12 CON_RS232.2
UART2_TX
  Top 0.3: IC_232.10 33.67,34.58 34.75,33.5 45.75,22.5 48,22.5 53,22.5 53.5,23 STM32.55
UART2_TXD_232
  Top 0.3: IC_232.7 23.07,34.58 22.75,34.25 22.75,32.75 22.25,32.25 20.75,32.25 20,33 20,38.87 18.75,40.12 CON_RS232.1
UART3_RX  (via drill 0.6)
  Top 0.3: IC_KLINE.1 21,15.6 21.25,15.6 | 21.25,15.6 21.5,15.6 22.41,15.6 23,15 24.25,15 v24.75,14.5 | v51.75,24.5 STM32.52 | R2.1 21.35,14.45 21.35,15.49 21.25,15.6
  Bottom 0.3: v24.75,14.5 27,14.5 28.5,16 44,16 46,18 46,22.5 48,24.5 v51.75,24.5
UART3_TX  (via drill 0.6)
  Top 0.3: v25.25,16.5 24.75,16 24.25,16 23.75,16 22.25,17.5 22.25,18.25 21.75,18.75 20.25,18.75 19.59,19.41 IC_KLINE.4 | v53.75,25.5 54.25,25 STM32.51
  Bottom 0.3: v25.25,16.5 27,16.5 27.5,17 43.5,17 45,18.5 45,23 48,26 53.25,26 v53.75,25.5
USB_CTRL  (via drill 0.6)
  Top 0.3: 81.75,26.25 79,26.25 78.75,26.5 78.25,27 v70.5,27 | 81.75,26.25 81.75,25.35 R17.2 | 81.75,26.25 81.75,27.15 R15.1 82,27.1 82.4,27.1 83,26.5 85.25,26.5 86,27.25 JP1.D+ | STM32.39 v64.75,26.75
  Bottom 0.3: v64.75,26.75 70.25,26.75 v70.5,27
USB_DETECT
  Top 0.3: STM32.4 61.75,15.25 61,14.5 61,12.75 60,11.75 56.5,11.75 55.75,12.5 54.5,13.75 54.5,15.75 52.5,17.75 38.75,17.75 38,17 29.25,17 28.25,18 28.25,20.75 29.08,21.58 Q2.12
USB_DM
  Top 0.3: STM32.44 62.25,26.5 62.75,26 63,25.75 67.25,25.75 69.38,27.88 | R16.2 70.5,29 69.38,27.88 | 69.38,27.88 69.5,28
USB_DP
  Top 0.3: STM32.45 61.75,26.25 62.75,25.25 67.5,25.25 69.75,27.5 70.5,28.25 78.25,28.25 79.25,27.25 R15.2 79.9,27.5
USB_VBUS  (via drill 0.6)
  Top 0.3: Q2.5 27.33,21.58 28.5,22.75 28.5,27.75 29.5,28.75 31.5,28.75 32.75,28.75 v33.25,28.25
  Top 0.5: v83.25,31.25 83.85,31.25 D5.2
  Top 0.8: JP1.VBUS 84.02,24.23 84.75,23.5 90.25,23.5 TP4.P$1
  Bottom 0.3: v33.25,28.25 33.25,37.25 35.5,39.5 49.75,39.5 53.25,43 72.5,43 73.75,43 76.5,40.25 76.5,37.75 75,36.25 75,31.75 76.5,30.25 82.25,30.25
  Bottom 0.8: JP1.VBUS 83.25,25.25 82.25,26.25 82.25,30.25 v83.25,31.25
VCC
  Top 0.3: D1.1 8.54,6.46 6,9 3.75,9 TP3.P$1
  Top 0.8: D1.1 9.34,5.16 9.75,4.75 F1.2
VCC_DETECT  (via drill 0.6)
  Top 0.3: STM32.57 54,22 53.5,21.5 44.25,21.5 v40,25.75 | v36.5,22.75 36.25,22.75 35.25,23.75 35.25,24.75 33.75,26.25 33.25,26.75 30.72,26.75 Q2.16
  Bottom 0.3: v40,25.75 39.5,25.75 v36.5,22.75
VCC_PROT  (via drill 0.6)
  Top 0.3: F1.1 13.75,4.75 14.5,5.5 16.25,5.5 18.75,8 18.75,11.5 15.5,14.75 15.5,16.25 v15.25,16.5 15,16.75 13.75,16.75 IC_KLINE.7 11.87,16.86 11.5,16.5 7.75,16.5 7.25,16 5,16 4.25,16.75 D6.2 | Q2.1 22.91,26.66 20.5,24.25 v15,24.25
  Top 0.5: VR1.8 17.55,1.34 C1.1
  Top 0.8: F1.1 13.15,2.75 TVS1.C 14.3,2.4 C1.1
  Bottom 0.3: v15,24.25 15,22.5 15.25,22.25 v15.25,16.5
VDDA
  Top 0.3: VR3.5 71.55,11.45 70.5,12.5 69.85,12.5 C30.1 C31.1 66.25,14.6 STM32.13

### Text on the board
bPlace: GND | RX | TX | RS232 | MotoLink | REV B | Github.com / /fpoussin / /MotoLink
tNames: MotoLink
bNames: DEBUG | BOOT0